# EAGLE schematic Sediment Board single (EAGLE 7.6.0)

## Sheet 1 of 2
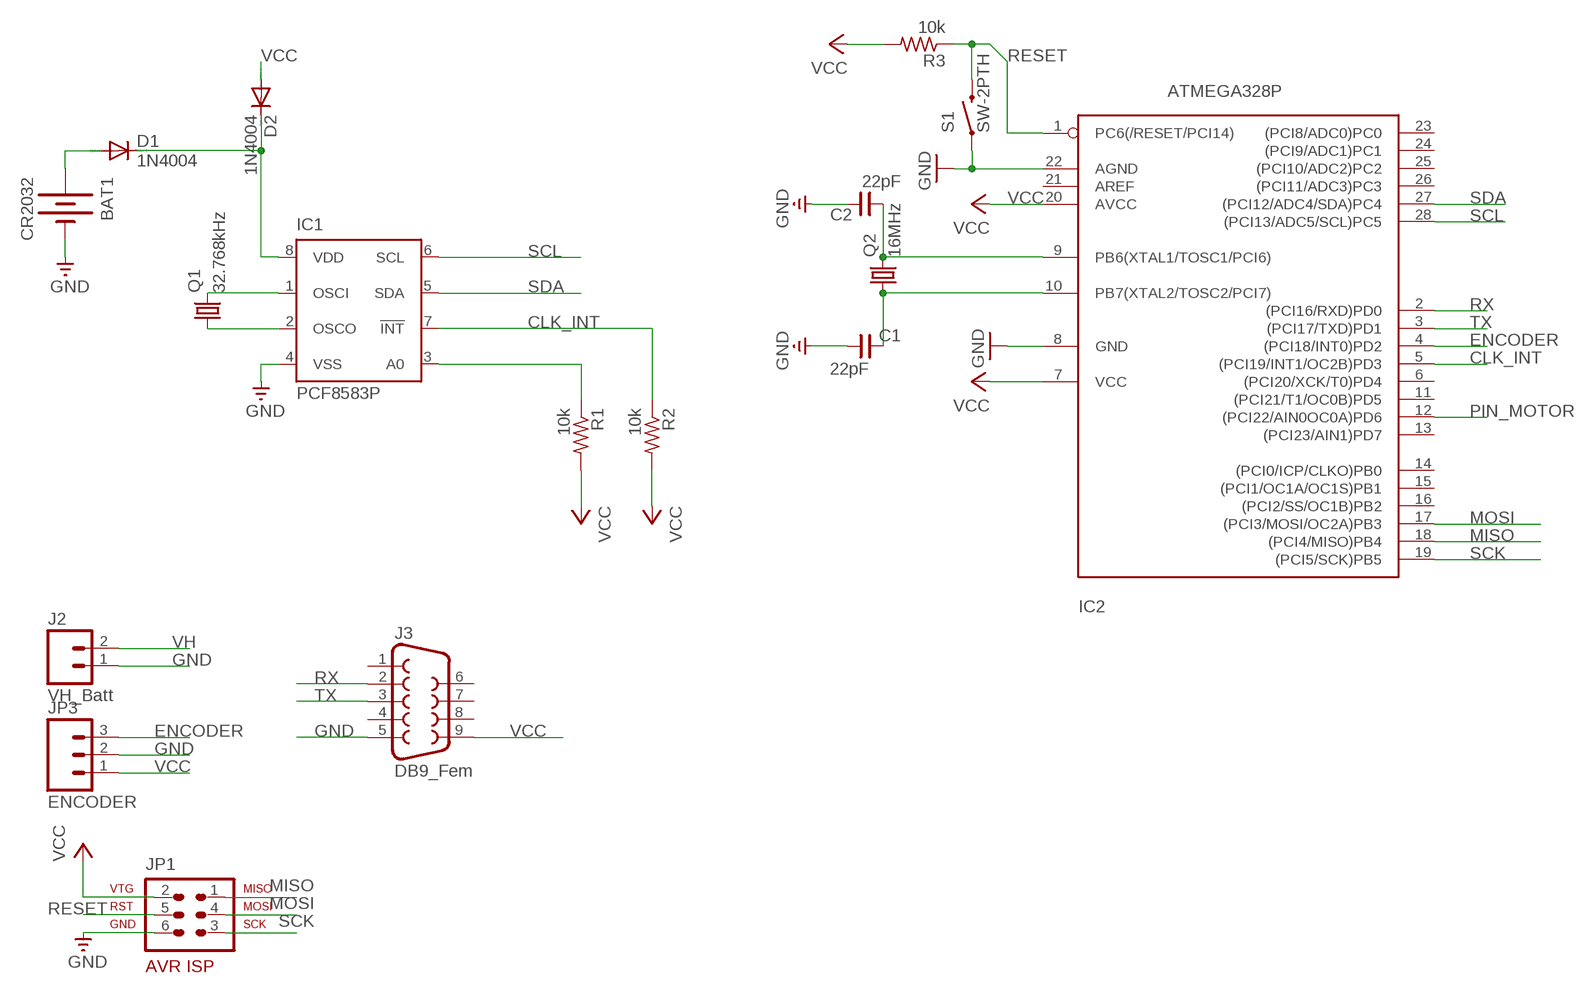
[diagram p0: schematic, sheet 1]

### Parts
BAT1  CR2032  BATTERY20PTH  [BATTCOM_20MM_PTH]
C1  22pF  CNP-C025-050X025  [C025-050X025]
C2  22pF  CNP-C025-050X025  [C025-050X025]
D1  1N4004  [DO41-10]
D2  1N4004  [DO41-10]
IC1  PCF8583P  [DIL08]
IC2  ATMEGA328P  ATMEGA328PROUND  [DIL28-3-ROUND]
J2  VH_Batt  M023.5MM  [SCREWTERMINAL-3.5MM-2]
J3  DB9_Fem  DB9FEMALE  [DB9]
JP1  AVR-ISP-6  [AVR-ISP-6]
JP3  ENCODER  M03POLAR  [MOLEX-1X3]
Q1  32.768kHz  CRYSTALTC26H  [TC26H]
Q2  16MHz  CRYSTALHC49U70  [HC49U70]
R1  10k  R-US_0207/10  [0207/10]
R2  10k  R-US_0207/10  [0207/10]
R3  10k  R-US_0207/10  [0207/10]
S1  SW-2PTH  SWITCH-MOMENTARY-2PTH  [TACTILE-PTH]

### Nets
CLK_INT: IC1.7(!INT) IC2.5((PCI19/INT1/OC2B)PD3) R2.1
ENCODER: IC2.4((PCI18/INT0)PD2) JP3.3
GND: BAT1.2(-) C1.1 C2.2 IC1.4(VSS) IC2.8(GND) IC2.22(AGND) J2.1 J3.5 JP1.6 JP3.2 S1.1 ; also sheet 2
MISO: IC2.18((PCI4/MISO)PB4) JP1.1
MOSI: IC2.17((PCI3/MOSI/OC2A)PB3) JP1.4
N$1: D1.C D2.C IC1.8(VDD)
N$2: IC1.1(OSCI) Q1.2
N$3: IC1.2(OSCO) Q1.1
N$5: BAT1.1(+) D1.A
N$6: IC1.3(A0) R1.1
N$7: C2.1 IC2.9(PB6(XTAL1/TOSC1/PCI6)) Q2.2
N$8: C1.2 IC2.10(PB7(XTAL2/TOSC2/PCI7)) Q2.1
PIN_MOTOR: IC2.12((PCI22/AIN0OC0A)PD6) ; also sheet 2
RESET: IC2.1(PC6(/RESET/PCI14)) JP1.5 R3.1 S1.3
RX: IC2.2((PCI16/RXD)PD0) J3.2
SCK: IC2.19((PCI5/SCK)PB5) JP1.3
SCL: IC1.6(SCL) IC2.28((PCI13/ADC5/SCL)PC5)
SDA: IC1.5(SDA) IC2.27((PCI12/ADC4/SDA)PC4)
TX: IC2.3((PCI17/TXD)PD1) J3.3
VCC: D2.A IC2.7(VCC) IC2.20(AVCC) J3.9 JP1.2 JP3.1 R1.2 R2.2 R3.2 ; also sheet 2
VH: J2.2 ; also sheet 2
Unconnected: IC2.6((PCI20/XCK/T0)PD4) IC2.11((PCI21/T1/OC0B)PD5) IC2.13((PCI23/AIN1)PD7) IC2.14((PCI0/ICP/CLKO)PB0) IC2.15((PCI1/OC1A/OC1S)PB1) IC2.16((PCI2/SS/OC1B)PB2) IC2.21(AREF) IC2.23((PCI8/ADC0)PC0) IC2.24((PCI9/ADC1)PC1) IC2.25((PCI10/ADC2)PC2) IC2.26((PCI11/ADC3)PC3) J3.1 J3.4 J3.6 J3.7 J3.8

## Sheet 2 of 2
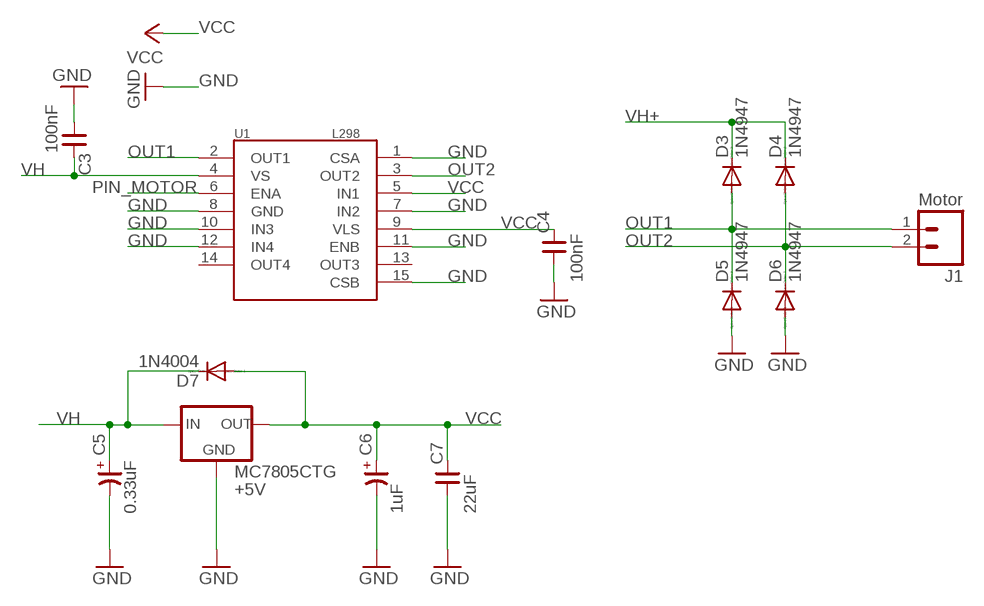
[diagram p1: schematic, sheet 2]

### Parts
C3  100nF  CNP-C025-050X025  [C025-050X025]
C4  100nF  CNP-C025-050X025  [C025-050X025]
C5  0.33uF  CP-TT025-040  [TT-025-040]
C6  1uF  CP-TT025-040  [TT-025-040]
C7  22uF  CNP-C025-050X025  [C025-050X025]
D3  1N4947  1N4942  [DO41-10]
D4  1N4947  1N4942  [DO41-10]
D5  1N4947  1N4942  [DO41-10]
D6  1N4947  1N4942  [DO41-10]
D7  1N4004  [DO41-10]
J1  Motor  M023.5MM  [SCREWTERMINAL-3.5MM-2]
MC7805CTG  +5V  V_REG_78XXSIDE  [78XXL]
U1  L298  [MULTIWATT15]

### Nets
GND: C3.1 C4.1 C5.- C6.- C7.1 D5.A D6.A MC7805CTG.GND U1.1(CSA) U1.7(IN2) U1.8(GND) U1.10(IN3) U1.11(ENB) U1.12(IN4) U1.15(CSB) ; also sheet 1
OUT1: D3.A D5.C J1.1 U1.2(OUT1)
OUT2: D4.A D6.C J1.2 U1.3(OUT2)
PIN_MOTOR: U1.6(ENA) ; also sheet 1
VCC: C4.2 C6.+ C7.2 D7.A MC7805CTG.OUT U1.5(IN1) U1.9(VLS) ; also sheet 1
VH: C3.2 C5.+ D7.C MC7805CTG.IN U1.4(VS) ; also sheet 1
VH+: D3.C D4.C
Unconnected: U1.13(OUT3) U1.14(OUT4)

## Library data of the parts
BAT1 = SparkFun:BATTERY: Battery Holders Various common sizes : AA, AAA, 20mm coin cell and 12mm coin cell.
C1-C4 C7 = cap-master:CNP-: NON-POLARIZED CAP
C5 C6 = cap-master:CP-: POLARIZED CAP
D1 D2 D7 = diode:1N4004: DIODE general purpose rectifier, 1 A
D3-D6 = diode:1N4942: DIODE 1.0 A, 200 V, 150 ns
IC1 = ds1307_pcf8583:PCF8583: I2C-Bus CLOCK/CALENDAR
IC2 = atmega328:ATMEGA328*P: MICROCONTROLLER 32 kBytes FLASH 2 kBytes SRAM 1 kBytes EEPROM USART 8-channel 10 bit ADC
J1 J2 = SparkFun-Connectors:M02: Standard 2-pin 0.1" header. Use with - straight break away headers ( PRT-00116) - right angle break away headers (PRT-00553) - swiss pins (PRT-00743) - machine pins (PRT-00117) - female headers (PRT-00115) Molex polarized connector foot print use with: PRT-08233 with associated crimp pins and housings. 2.54_SCREWTERM for use with PRT-10571. 3.5mm Screw Terminal footprints for PRT-08084 5mm Screw Terminal footprints for use with PRT-08432; PROD_ID: CONN-08399
J3 = SparkFun-Connectors:DB9: DB9 Connector Standard DB9 (D-Sub 9) serial connector. Can be used for CAN bus as well as RS485 and RS232. Footprint production proven. Spark Fun Electronics SKU : PRT-00429; PROD_ID: CONN-08194
JP1 = atmel-1:AVR-ISP-6: AVR ISP-6 Serial Programming Header
JP3 = SparkFun:M03: Header 3 Standard 3-pin 0.1" header. Use with straight break away headers (SKU : PRT-00116), right angle break away headers (PRT-00553), swiss pins (PRT-00743), machine pins (PRT-00117), and female headers (PRT-00115). Molex polarized connector foot print use with SKU : PRT-08232 with associated crimp pins and housings.
MC7805CTG = SparkFun:V_REG_78XX: Voltage Regulator Standard 7805 5V regulator. IGO (Input Ground Output). Spark Fun Electronics SKU : COM-00107
Q1 Q2 = crystal:CRYSTAL: CRYSTAL; OC_FARNELL: unknown; OC_NEWARK: unknown
R1-R3 = resistor:R-US_: RESISTOR, American symbol
S1 = SparkFun:SWITCH-MOMENTARY-2
U1 = SparkFun:L298: L298 Dual Full Bridge Driver

## Net classes
0 default: clearance 0.205 mm